# EAGLE design Kernal64Cart (EAGLE 9.6.2)
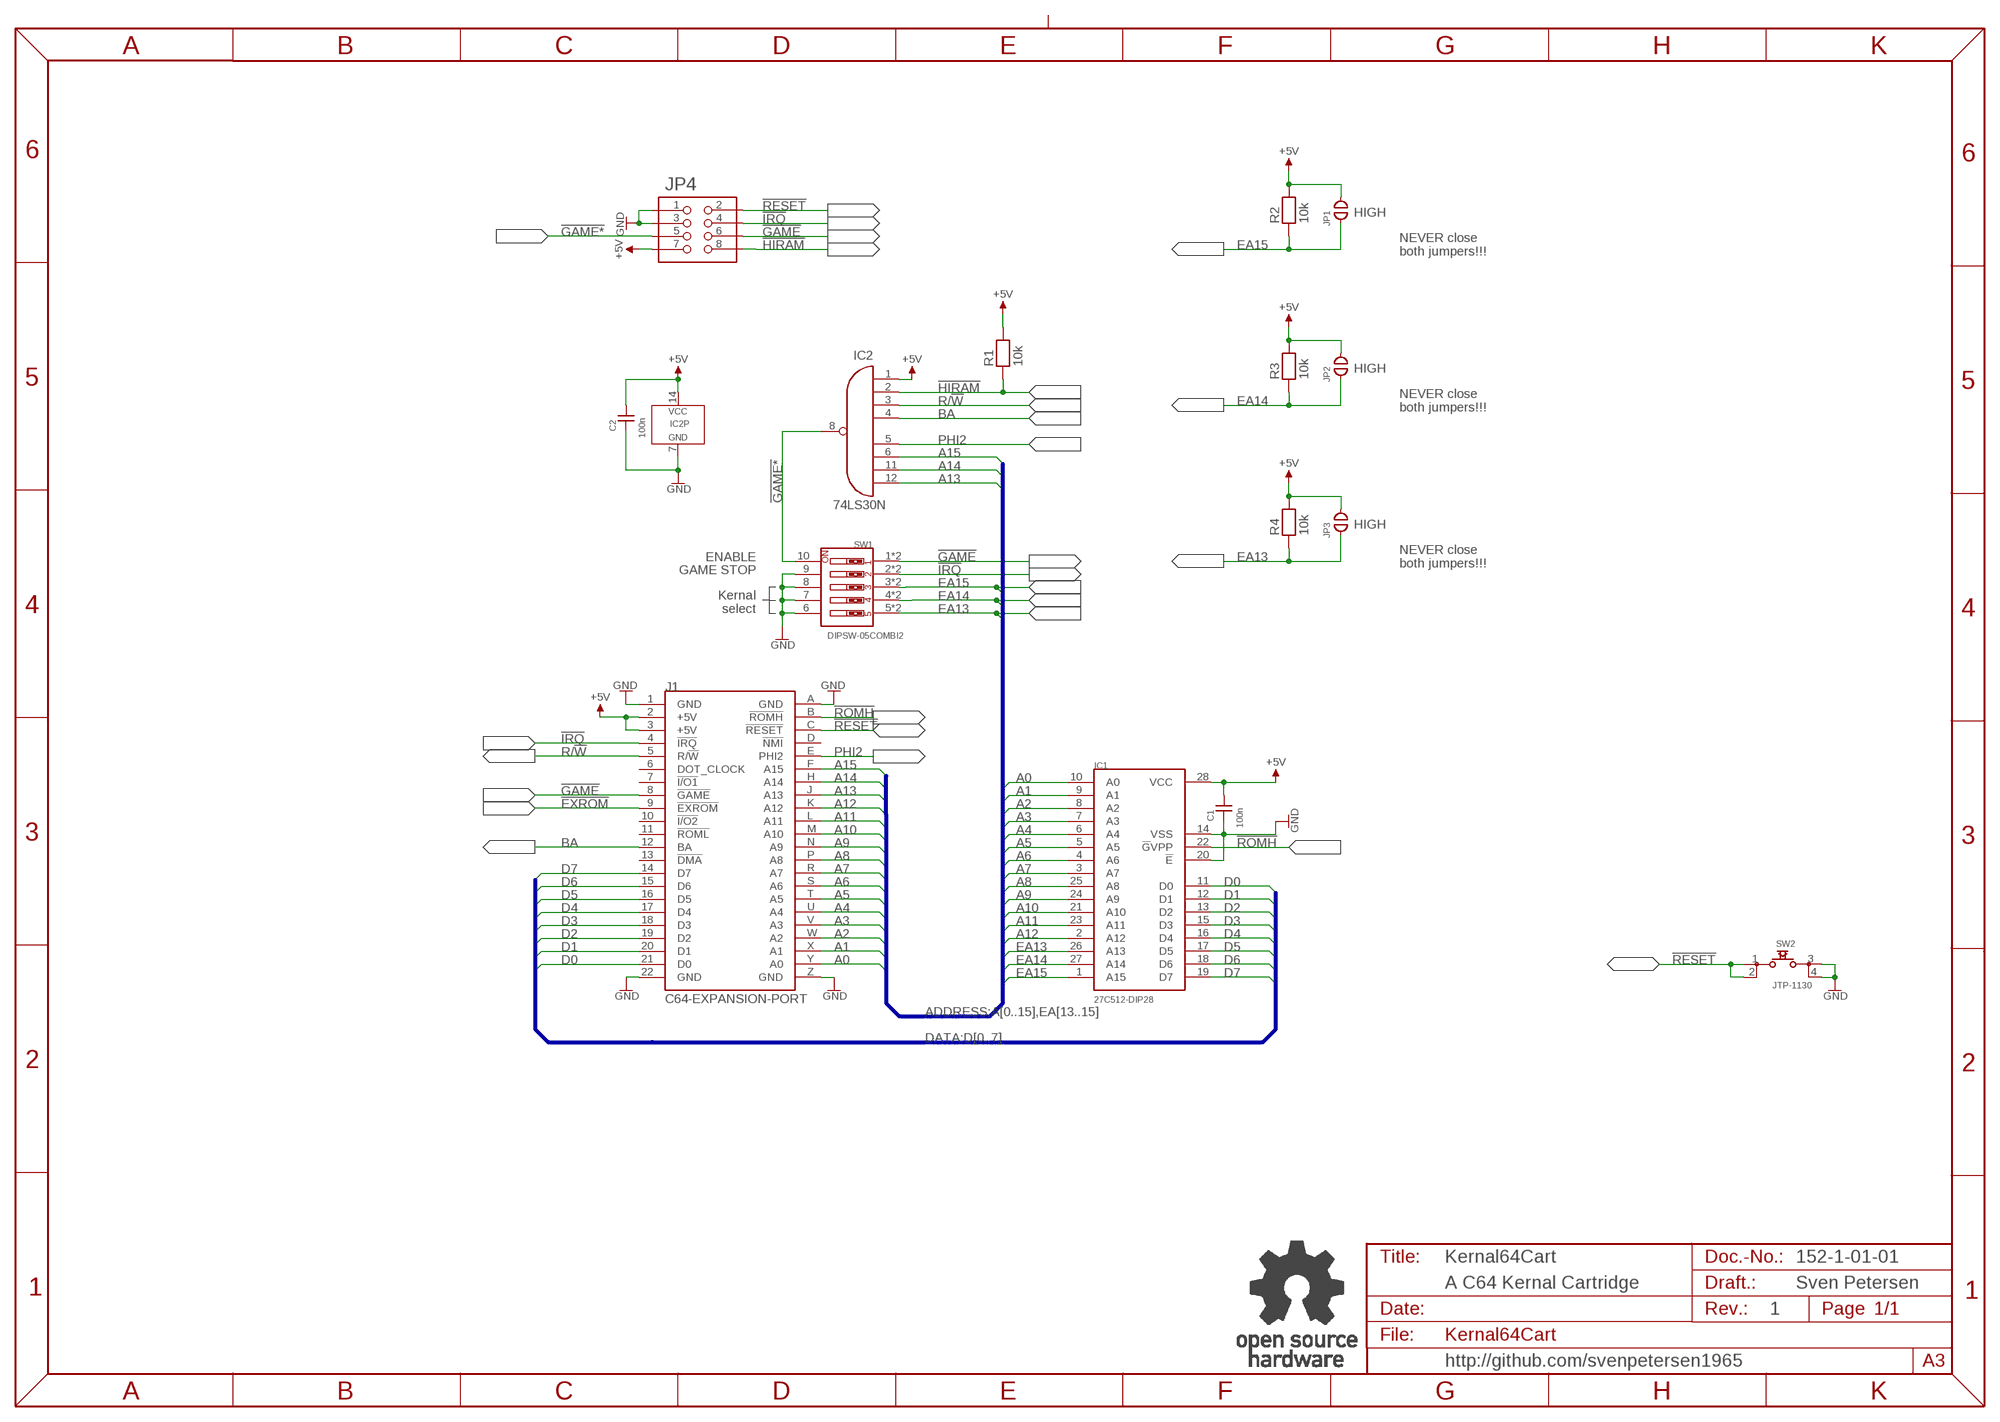
[diagram p0: schematic, sheet 1]

## Parts
C1  100n  CAP01  [C-2,5]
C2  100n  CAP01  [C-2,5]
IC1  27C512-DIP28  M27C512-DIP28  [DIL28-6]
IC2  74LS30N  7430DIP  [DIL-14]
J1  C64-EXPANSION-PORT  C64-EXPANSIONPNARROW  [EXPANSIO_SQ]
JP1  OPEN  [CP_OP]
JP2  OPEN  [CP_OP]
JP3  OPEN  [CP_OP]
JP4  PINHD-2X490°/MPE_088  [2X04_90_SERIES_088]
R1  10k  RES04  [R-10]
R2  10k  RES04  [R-10]
R3  10k  RES04  [R-10]
R4  10k  RES04  [R-10]
SW1  DIPSW-05COMBI2  [DIPSW-05V-COMBI2]
SW2  JTP-1130  [JTP-1130]
U$50  OPEN_SOURCE_HW  [OPENHW]

## Nets
!EXROM: J1.9(!EXROM)
!GAME: J1.8(!GAME) JP4.6 SW1.1 SW1.1A
!GAME*: IC2.8(O) JP4.5 SW1.10
!HIRAM: IC2.2(I1) JP4.8 R1.1
!IRQ: J1.4(!IRQ) JP4.4 SW1.2 SW1.2A
!RESET: J1.C(!RESET) JP4.2 SW2.1 SW2.2
!ROMH: IC1.22(!G!VPP) J1.B(!ROMH)
+5V: C1.2 C2.2 IC1.28(VCC) IC2.1(I0) IC2.14(VCC) J1.2(+5V) J1.3(+5V) JP1.2 JP2.2 JP3.2 JP4.7 R1.2 R2.2 R3.2 R4.2
A0: IC1.10(A0) J1.Y(A0)
A1: IC1.9(A1) J1.X(A1)
A2: IC1.8(A2) J1.W(A2)
A3: IC1.7(A3) J1.V(A3)
A4: IC1.6(A4) J1.U(A4)
A5: IC1.5(A5) J1.T(A5)
A6: IC1.4(A6) J1.S(A6)
A7: IC1.3(A7) J1.R(A7)
A8: IC1.25(A8) J1.P(A8)
A9: IC1.24(A9) J1.N(A9)
A10: IC1.21(A10) J1.M(A10)
A11: IC1.23(A11) J1.L(A11)
A12: IC1.2(A12) J1.K(A12)
A13: IC2.12(I7) J1.J(A13)
A14: IC2.11(I6) J1.H(A14)
A15: IC2.6(I5) J1.F(A15)
BA: IC2.4(I3) J1.12(BA)
D0: IC1.11(D0) J1.21(D0)
D1: IC1.12(D1) J1.20(D1)
D2: IC1.13(D2) J1.19(D2)
D3: IC1.15(D3) J1.18(D3)
D4: IC1.16(D4) J1.17(D4)
D5: IC1.17(D5) J1.16(D5)
D6: IC1.18(D6) J1.15(D6)
D7: IC1.19(D7) J1.14(D7)
EA13: IC1.26(A13) JP3.1 R4.1 SW1.5 SW1.5A
EA14: IC1.27(A14) JP2.1 R3.1 SW1.4 SW1.4A
EA15: IC1.1(A15) JP1.1 R2.1 SW1.3 SW1.3A
GND: C1.1 C2.1 IC1.14(VSS) IC1.20(!E) IC2.7(GND) J1.1(GND) J1.22(GND) J1.A(GND) J1.Z(GND) JP4.1 JP4.3 SW1.6 SW1.7 SW1.8 SW1.9 SW2.3 SW2.4
PHI2: IC2.5(I4) J1.E(PHI2)
R/!W: IC2.3(I2) J1.5(R/!W)
Unconnected: J1.6(DOT_CLOCK) J1.7(!I/O1) J1.10(!I/O2) J1.11(!ROML) J1.13(!DMA) J1.D(!NMI)

## Buses
DATA:D[0..7]
ADDRESS:A[0..15],EA[13..15]

## Notes on the sheet
- HIGH
- NEVER close
  both jumpers!!!
- HIGH
- NEVER close
  both jumpers!!!
- HIGH
- ENABLE
- NEVER close
  both jumpers!!!
- GAME STOP
- Kernal
  select
- Kernal64Cart | 152-1-01-01
- A C64 Kernal Cartridge | Sven Petersen
- 1
- http://github.com/svenpetersen1965

## Library data of the parts
C1 C2 = DISCRETE:CAP01
IC1 = ST:M27C512
IC2 = 74XX:7430
J1 = Commodore:C64-EXPANSIONP
JP1-JP3 = Cutpad:OPEN: open Cutpad
JP4 = PINHEAD:PINHD-2X4
R1-R4 = DISCRETE:RES04
SW1 = DIPSWITCH:DIPSW-05
SW2 = Namae_Electronics:JTP-1130
U$50 = Logo:OPEN_SOURCE_HW

## Board
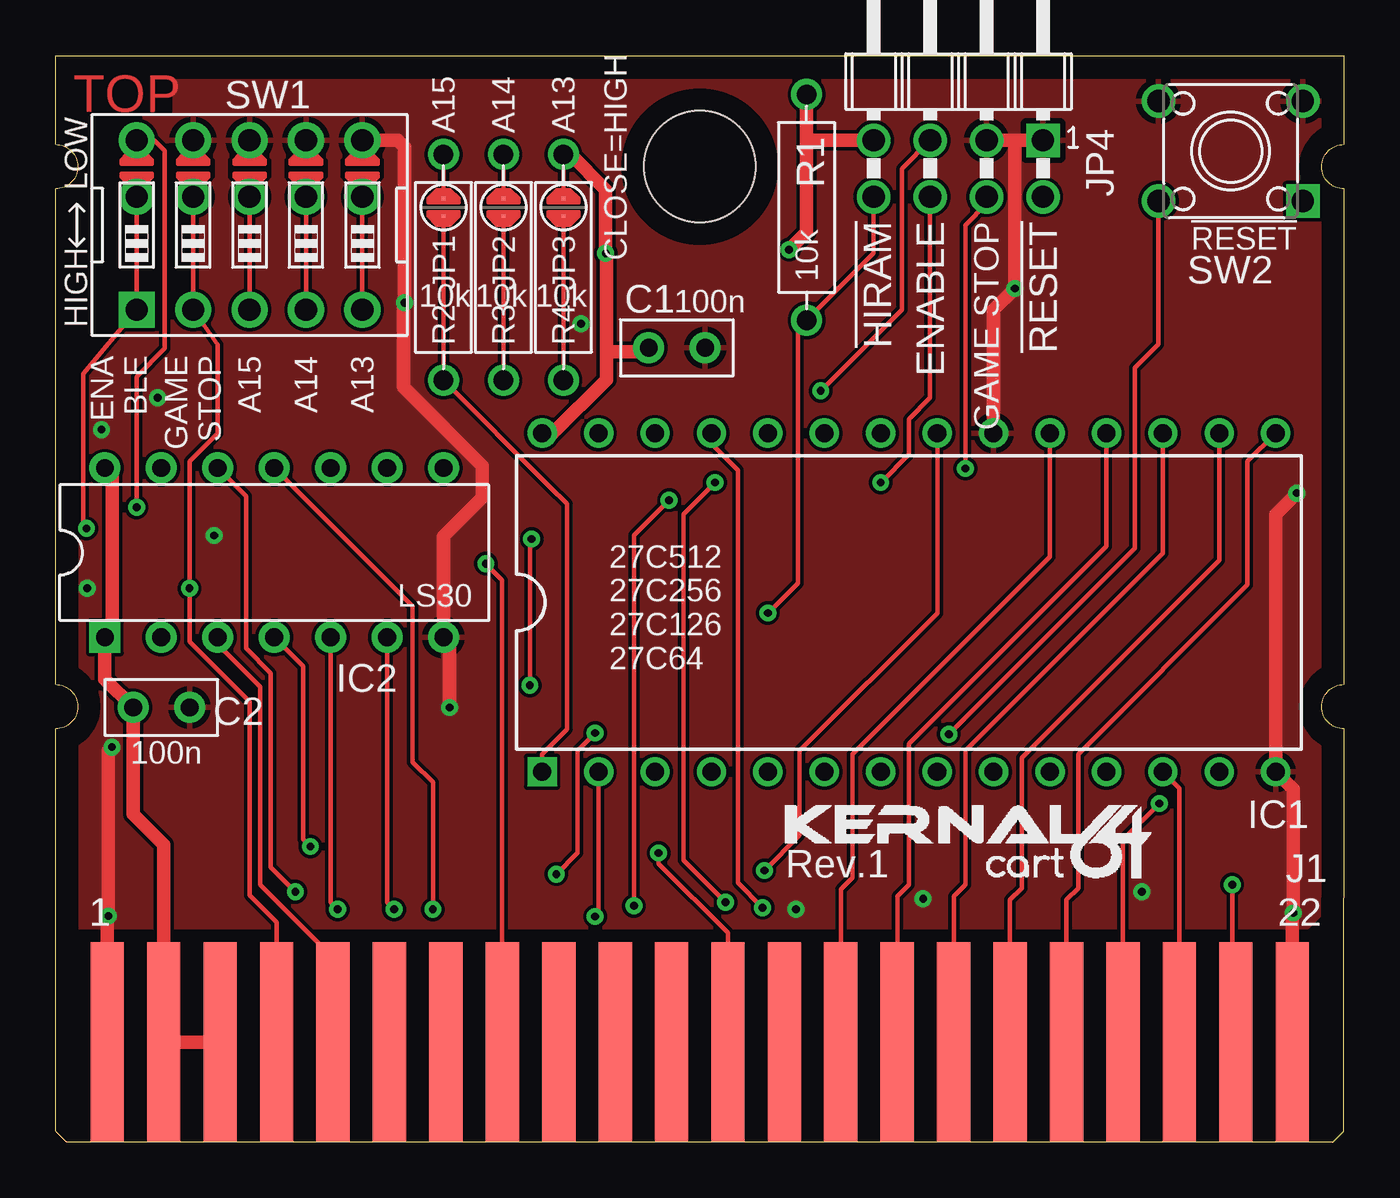
[diagram p1: board, top side]
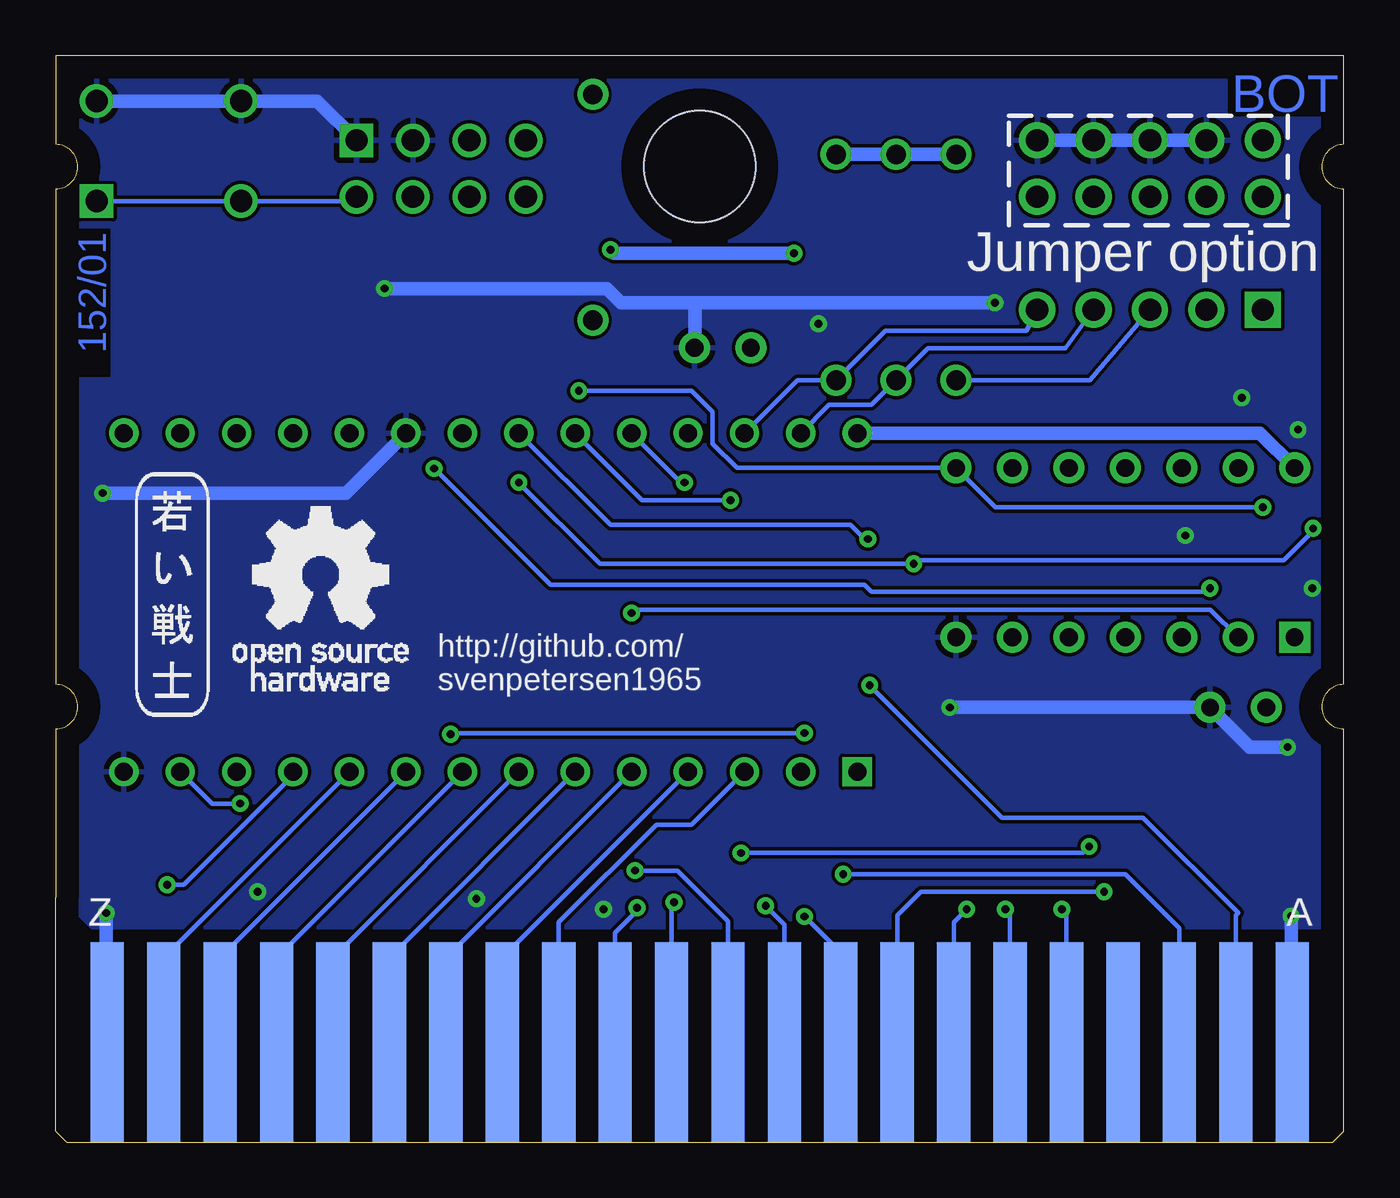
[diagram p2: board, bottom side, seen from below]

Size 58 x 48.9 mm. Coordinates in mm from the lower left corner, seen from the top.
Outline: 0,11 0,18.6 arc180 0,20.6 0,42.9 arc180 0,44.9 0,48.9 58,48.9 58,44.9 arc180 58,42.9 58,20.6 arc180 58,18.6 58,11
Copper layers (1*16): Top 0.035mm / dielectric 1.5mm / Bottom 0.035mm
Design rules "default *": minimum track width 6mil, minimum drill 0.35mm, track to track 6mil, track to pad 6mil, pad to pad 6mil, via to via 6mil, smd to smd 6mil, copper to edge 40mil, drill to drill 6mil, minimum pad ring 10mil, minimum via ring 8mil, stop-mask expansion 4mil, vias tented up to drill 24mil, thermal gap 10mil
Holes 5 mm at 29,43.9
bRestrict: 3 lines

### Footprints (pad centres in the part's own frame; a part is rotated, then mirrored left to right if it is on the bottom)
C-2,5 = drill 0.8 pad 1.397: 1 -1.27,0; 2 1.27,0
DIL28-6 = drill 0.813 square: 1 -16.51,-7.62 | drill 0.813: 2 -13.97,-7.62; 3 -11.43,-7.62; 4 -8.89,-7.62; 5 -6.35,-7.62; 6 -3.81,-7.62; 7 -1.27,-7.62; 8 1.27,-7.62; 9 3.81,-7.62; 10 6.35,-7.62; 11 8.89,-7.62; 12 11.43,-7.62; 13 13.97,-7.62; 14 16.51,-7.62; 15 16.51,7.62; 16 13.97,7.62; 17 11.43,7.62; 18 8.89,7.62; 19 6.35,7.62; 20 3.81,7.62; 21 1.27,7.62; 22 -1.27,7.62; 23 -3.81,7.62; 24 -6.35,7.62; 25 -8.89,7.62; 26 -11.43,7.62; 27 -13.97,7.62; 28 -16.51,7.62
DIL-14 = drill 0.8 pad 1.397 square: 1 -7.62,-3.81 | drill 0.8 pad 1.397: 2 -5.08,-3.81; 3 -2.54,-3.81; 4 0,-3.81; 5 2.54,-3.81; 6 5.08,-3.81; 7 7.62,-3.81; 8 7.62,3.81; 9 5.08,3.81; 10 2.54,3.81; 11 0,3.81; 12 -2.54,3.81; 13 -5.08,3.81; 14 -7.62,3.81
EXPANSIO_SQ = smd 1.5 x 9: 1 26.67,-4.5; 2 24.13,-4.5; 3 21.59,-4.5; 4 19.05,-4.5; 5 16.51,-4.5; 6 13.97,-4.5; 7 11.43,-4.5; 8 8.89,-4.5; 9 6.35,-4.5; 10 3.81,-4.5; 11 1.27,-4.5; 12 -1.27,-4.5; 13 -3.81,-4.5; 14 -6.35,-4.5; 15 -8.89,-4.5; 16 -11.43,-4.5; 17 -13.97,-4.5; 18 -16.51,-4.5; 19 -19.05,-4.5; 20 -21.59,-4.5; 21 -24.13,-4.5; 22 -26.67,-4.5 | smd 1.5 x 9 bottom: A 26.67,-4.5; B 24.13,-4.5; C 21.59,-4.5; D 19.05,-4.5; E 16.51,-4.5; F 13.97,-4.5; H 11.43,-4.5; J 8.89,-4.5; K 6.35,-4.5; L 3.81,-4.5; M 1.27,-4.5; N -1.27,-4.5; P -3.81,-4.5; R -6.35,-4.5; S -8.89,-4.5; T -11.43,-4.5; U -13.97,-4.5; V -16.51,-4.5; W -19.05,-4.5; X -21.59,-4.5; Y -24.13,-4.5; Z -26.67,-4.5
CP_OP = smd 0.152 x 0.152: 1 -0.4,0; 2 0.4,0
2X04_90_SERIES_088 = drill 1 square: 1 -3.81,-1.27 | drill 1: 2 -3.81,1.27; 3 -1.27,-1.27; 4 -1.27,1.27; 5 1.27,-1.27; 6 1.27,1.27; 7 3.81,-1.27; 8 3.81,1.27
R-10 = drill 0.889 pad 1.397: 1 -5.08,0; 2 5.08,0
DIPSW-05V-COMBI2 = drill 1 pad 1.626 square: 1 -5.08,-3.81 | drill 1 pad 1.626: 1A -5.08,1.27; 2 -2.54,-3.81; 2A -2.54,1.27; 3 0,-3.81; 3A 0,1.27; 4 2.54,-3.81; 4A 2.54,1.27; 5 5.08,-3.81; 5A 5.08,1.27; 6 5.08,3.81; 7 2.54,3.81; 8 0,3.81; 9 -2.54,3.81; 10 -5.08,3.81
JTP-1130 = drill 1 square: 1 3.25,-2.25 | drill 1: 2 -3.25,-2.25; 3 3.25,2.25; 4 -3.25,2.25

### Placement (x,y rotation side)
C1  27.97,35.75 180 top
C2  4.76,19.56 180 top
IC1  38.42,24.29 0 top
IC2  9.84,26.53 0 top
J1  29,0 180 top
JP1  17.46,42.07 90 top
JP2  20.16,42.07 90 top
JP3  22.86,42.07 90 top
JP4  40.64,43.81 180 top
R1  33.81,42.07 90 top
R2  17.46,39.37 90 top
R3  20.16,39.37 90 top
R4  22.86,39.37 90 top
SW1  8.73,41.27 0 top
SW2  52.9,44.6 0 top
U$39  [KERNAL64CART]  32.86,11.91 0 top
U$40  [2LAYER]  0.79,46.35 0 top
U$41  [PCB-TITLE/]  0,60.96 0 top  (outside the outline)
U$42  [SVEN_TAG]  52.7,24.77 0 bottom
U$50  50.01,20.32 0 bottom

### Tracks (layer width: path | path; a pad name or v marks a point on that pad's centre or on a via)
!GAME  (via drill 0.35)
  Top 0.203: J1.8 20.11,25.29 v19.37,26.04 | v1.39,27.62 1.24,27.78 1.24,34.57 SW1.1 SW1.1A | v37.15,29.69 38.42,30.96 38.42,32.54 39.37,33.5 JP4.6
  Bottom 0.203: v1.39,27.62 1.27,27.62 2.7,26.19 19.21,26.19 v19.37,26.04 33.5,26.04 v37.15,29.69
!GAME*  (via drill 0.35)
  Top 0.203: v3.65,28.57 3.65,34.45 4.92,35.72 4.92,44.61 4.45,45.09 SW1.10 | v34.45,33.81 38.1,37.47 38.1,43.81 JP4.5
  Bottom 0.203: v3.65,28.57 15.7,28.57 IC2.8 27.32,30.34 28.42,31.43 28.42,32.86 29.37,33.81 v34.45,33.81
!HIRAM  (via drill 0.35)
  Top 0.203: JP4.8 36.83,40.01 R1.1 33.42,36.59 33.42,25.16 v32.07,23.81
  Bottom 0.203: IC2.2 6.01,23.97 31.91,23.97 v32.07,23.81
!IRQ  (via drill 0.35)
  Top 0.203: J1.4 9.95,9.89 8.73,11.11 8.73,19.82 6.03,22.52 v6.03,24.92 6.03,30.64 7.3,31.91 7.3,35.88 SW1.2 SW1.2A | v40.96,30.32 40.96,41.27 41.91,42.23 JP4.4
  Bottom 0.203: v40.96,30.32 35.72,25.08 21.59,25.08 21.27,24.77 6.19,24.77 v6.03,24.92
!RESET  (via drill 0.35)
  Top 0.203: SW2.2 49.65,35.92 48.58,34.84 48.58,26.73 v40.21,18.36 | v22.54,12.06 23.5,13.02 23.5,17.62 v24.29,18.41
  Bottom 0.203: SW2.1 SW2.2 44.65,42.35 JP4.2 | J1.C 7.41,9.63 9.84,12.06 v22.54,12.06 | v24.29,18.41 40.16,18.41 v40.21,18.36
!ROMH  (via drill 0.35)
  Top 0.203: v21.35,20.56 21.35,27.07 v21.43,27.15
  Bottom 0.203: J1.B 4.87,10.21 4.76,10.32 9.05,14.61 15.4,14.61 v21.35,20.56 | IC1.22 33.02,27.78 22.23,27.78 21.59,27.15 v21.43,27.15
+5V  (via drill 0.35)
  Top 0.203: JP1.2 R2.2 | JP2.2 R3.2 | JP3.2 R4.2
  Top 0.61: v33.02,40.16 33.81,40.96 33.81,45.09 | 33.81,45.09 R1.2 | IC1.28 22.38,31.91 24.8,34.32 24.8,35.56 | J1.3 J1.2 4.87,13.39 3.49,14.76 C2.2 2.22,20.83 IC2.1 2.54,23.04 2.54,30.02 IC2.14 | R4.2 23.18,44.45 24.77,42.86 v24.77,40.01 24.8,39.97 24.8,35.56 | JP4.7 33.81,45.09 | C1.2 26.51,35.56 24.8,35.56
  Bottom 0.61: R2.2 R3.2 R4.2 | v24.77,40.01 32.86,40.01 v33.02,40.16 | IC2.14 3.79,31.91 IC1.28
A0
  Bottom 0.203: J1.Y 53.13,8.31 IC1.10
A1
  Bottom 0.203: J1.X 50.59,8.31 IC1.9
A2
  Bottom 0.203: J1.W 48.05,8.31 IC1.8
A3
  Bottom 0.203: J1.V 45.51,8.31 IC1.7
A4
  Bottom 0.203: J1.U 42.97,8.31 IC1.6
A5
  Bottom 0.203: J1.T 40.43,8.31 IC1.5
A6
  Bottom 0.203: J1.S 37.89,8.31 IC1.4
A7
  Bottom 0.203: J1.R 35.35,9.89 30.96,14.29 29.37,14.29 IC1.3
A8  (via drill 0.35)
  Top 0.203: v31.83,10.56 30.72,11.67 30.72,30.24 29.53,31.43 IC1.25
  Bottom 0.203: J1.P 32.81,9.42 31.75,10.48 v31.83,10.56
A9  (via drill 0.35)
  Top 0.203: v30.16,10.79 28.26,12.7 28.26,28.26 v29.69,29.69
  Bottom 0.203: J1.N 30.27,10.69 v30.16,10.79 | v29.69,29.69 29.84,29.69 IC1.24
A10  (via drill 0.35)
  Top 0.203: v31.91,12.22 33.5,13.81 33.5,17.62 39.69,23.81 IC1.21
  Bottom 0.203: J1.M 27.73,9.95 30,12.22 v31.91,12.22
A11  (via drill 0.35)
  Top 0.203: v26.04,10.64 26.04,27.3 v27.62,28.89
  Bottom 0.203: J1.L 25.19,9.79 v26.04,10.64 | v27.62,28.89 31.59,28.89 IC1.23
A12  (via drill 0.35)
  Top 0.203: v24.29,10.16 24.45,10.32 IC1.2
  Bottom 0.203: J1.K 22.65,8.52 v24.29,10.16
A13  (via drill 0.35)
  Top 0.203: IC2.12 8.57,29.07 8.57,22.23 9.68,21.11 9.68,12.38 v10.79,11.27
  Bottom 0.203: J1.J 20.11,10.21 19.05,11.27 v10.79,11.27
A14  (via drill 0.35)
  Top 0.203: v16.99,10.48 16.99,16.19 16.07,17.1 16.07,24.11 IC2.11
  Bottom 0.203: J1.H 17.57,9.89 v16.99,10.48
A15  (via drill 0.35)
  Top 0.203: IC2.6 14.92,10.79 v15.24,10.48
  Bottom 0.203: J1.F 15.03,10.27 v15.24,10.48
BA  (via drill 0.35)
  Top 0.203: J1.12 30.27,9.42 27.15,12.54 v27.15,13.02 | IC2.4 11.15,21.41 11.15,13.62 v11.47,13.31
  Bottom 0.203: v27.15,13.02 11.76,13.02 v11.47,13.31
D0  (via drill 0.35)
  Top 0.203: v52.97,11.59 52.97,4.66 J1.21
  Bottom 0.203: IC1.11 47.31,16.51 52.23,11.59 v52.97,11.59 | v52.97,11.59 53.02,11.59 v52.97,11.59
D1
  Top 0.203: J1.20 50.59,15.93 IC1.12
D2  (via drill 0.35)
  Top 0.203: J1.19 48.05,13.6 v49.69,15.24
  Bottom 0.203: v49.69,15.24 50.96,15.24 IC1.13
D3
  Top 0.203: J1.18 45.51,10.9 46.04,11.43 46.04,17.46 53.66,25.08 53.66,30.64 IC1.15
D4
  Top 0.203: J1.17 42.97,10.9 43.5,11.43 43.5,17.3 52.39,26.19 IC1.16
D5
  Top 0.203: J1.16 40.43,11.06 40.96,11.59 40.96,17.62 49.85,26.51 IC1.17
D6
  Top 0.203: J1.15 37.89,11.06 38.42,11.59 38.42,17.94 47.31,26.83 IC1.18
D7
  Top 0.203: J1.14 35.35,11.38 35.88,11.91 35.88,17.46 44.77,26.35 IC1.19
EA13
  Top 0.203: JP3.1 22.86,39.57 R4.1 | SW1.5 SW1.5A
  Bottom 0.203: IC1.26 24.61,34.29 R4.1 20.64,36.51 14.29,36.51 SW1.5
EA14
  Top 0.203: JP2.1 20.16,39.41 R3.1 | SW1.4 SW1.4A
  Bottom 0.203: IC1.27 23.18,33.18 21.27,33.18 R3.1 18.73,35.72 12.54,35.72 SW1.4
EA15
  Top 0.203: JP1.1 17.46,40.16 R2.1 22.23,29.53 23.02,28.73 23.02,18.57 21.91,17.46 IC1.1 | SW1.3 SW1.3A
  Bottom 0.203: SW1.3 11.43,34.29 R2.1
GND  (via drill 0.35)
  Top 0.61: J1.A 2.33,10.18 v2.38,10.18 2.38,17.62 v2.54,17.78 | J1.22 55.67,10.27 v55.72,10.32 55.72,15.88 IC1.14 54.93,28.26 v55.88,29.21 | IC1.20 42.23,37.47 v43.18,38.42 43.18,45.09 | v17.74,19.56 17.74,22.44 IC2.7 17.46,27.27 19.21,29.01 19.21,30.43 15.67,33.97 15.67,37.74 v15.72,37.78 15.72,44.77 15.4,45.09 SW1.6 | 43.18,45.09 42.86,45.09 JP4.3 | JP4.1 43.18,45.09
  Bottom 0.61: SW1.9 SW1.8 SW1.7 SW1.6 | v2.38,10.18 2.38,4.55 J1.A | SW2.3 SW2.4 46.22,46.85 JP4.1 | v43.18,38.42 37.47,38.42 33.18,38.42 32.54,37.78 29.21,37.78 | 29.21,37.78 v15.72,37.78 | v55.72,10.32 55.72,4.55 J1.22 | v55.88,29.21 44.93,29.21 IC1.20 | v2.54,17.78 4.25,17.78 C2.1 v17.74,19.56 | v17.74,19.56 17.78,19.53 v17.74,19.56 | C1.1 29.21,35.78 29.21,37.78
  other vias: 7.14,27.3 2.06,32.07 4.6,33.5 48.9,11.27 23.65,36.83 1.43,24.92 39.05,10.95 33.34,10.48
  pour Top: 0.64,48.26 0.64,10 0.95,9.68 56.36,9.68 57.15,10.48 57.15,48.26
  pour Bottom: 0.64,48.26 0.64,10 0.95,9.68 56.36,9.68 57.15,10.48 57.15,48.26
PHI2  (via drill 0.35)
  Top 0.203: IC2.5 12.38,10.79 v12.7,10.48
  Bottom 0.203: J1.E 12.49,10.27 v12.7,10.48
R/!W
  Top 0.203: J1.5 12.49,8.31 9.21,11.59 9.21,20.5 7.3,22.4 IC2.3

### Text on the board
Bottom: 152/01
tPlace: A15 | A14 | A13 | LOW | !HIRAM | ENABLE | GAME STOP | !RESET | CLOSE=HIGH | !RESET | 10k | 10k | 10k | 10k | 100n | HIGH | ENA / BLE | GAME / STOP | A15 | A14 | A13 | LS30 | 27C512 / 27C256 / 27C126 / 27C64 | 100n | Rev.1
bPlace: Jumper option | http://github.com/ / svenpetersen1965
Measures: 5.0
Document: 152-2-01-01 | Sven Petersen / 2022 | 35µm | 2 | 1